# EAGLE design DualRelayShield (EAGLE 5.11)
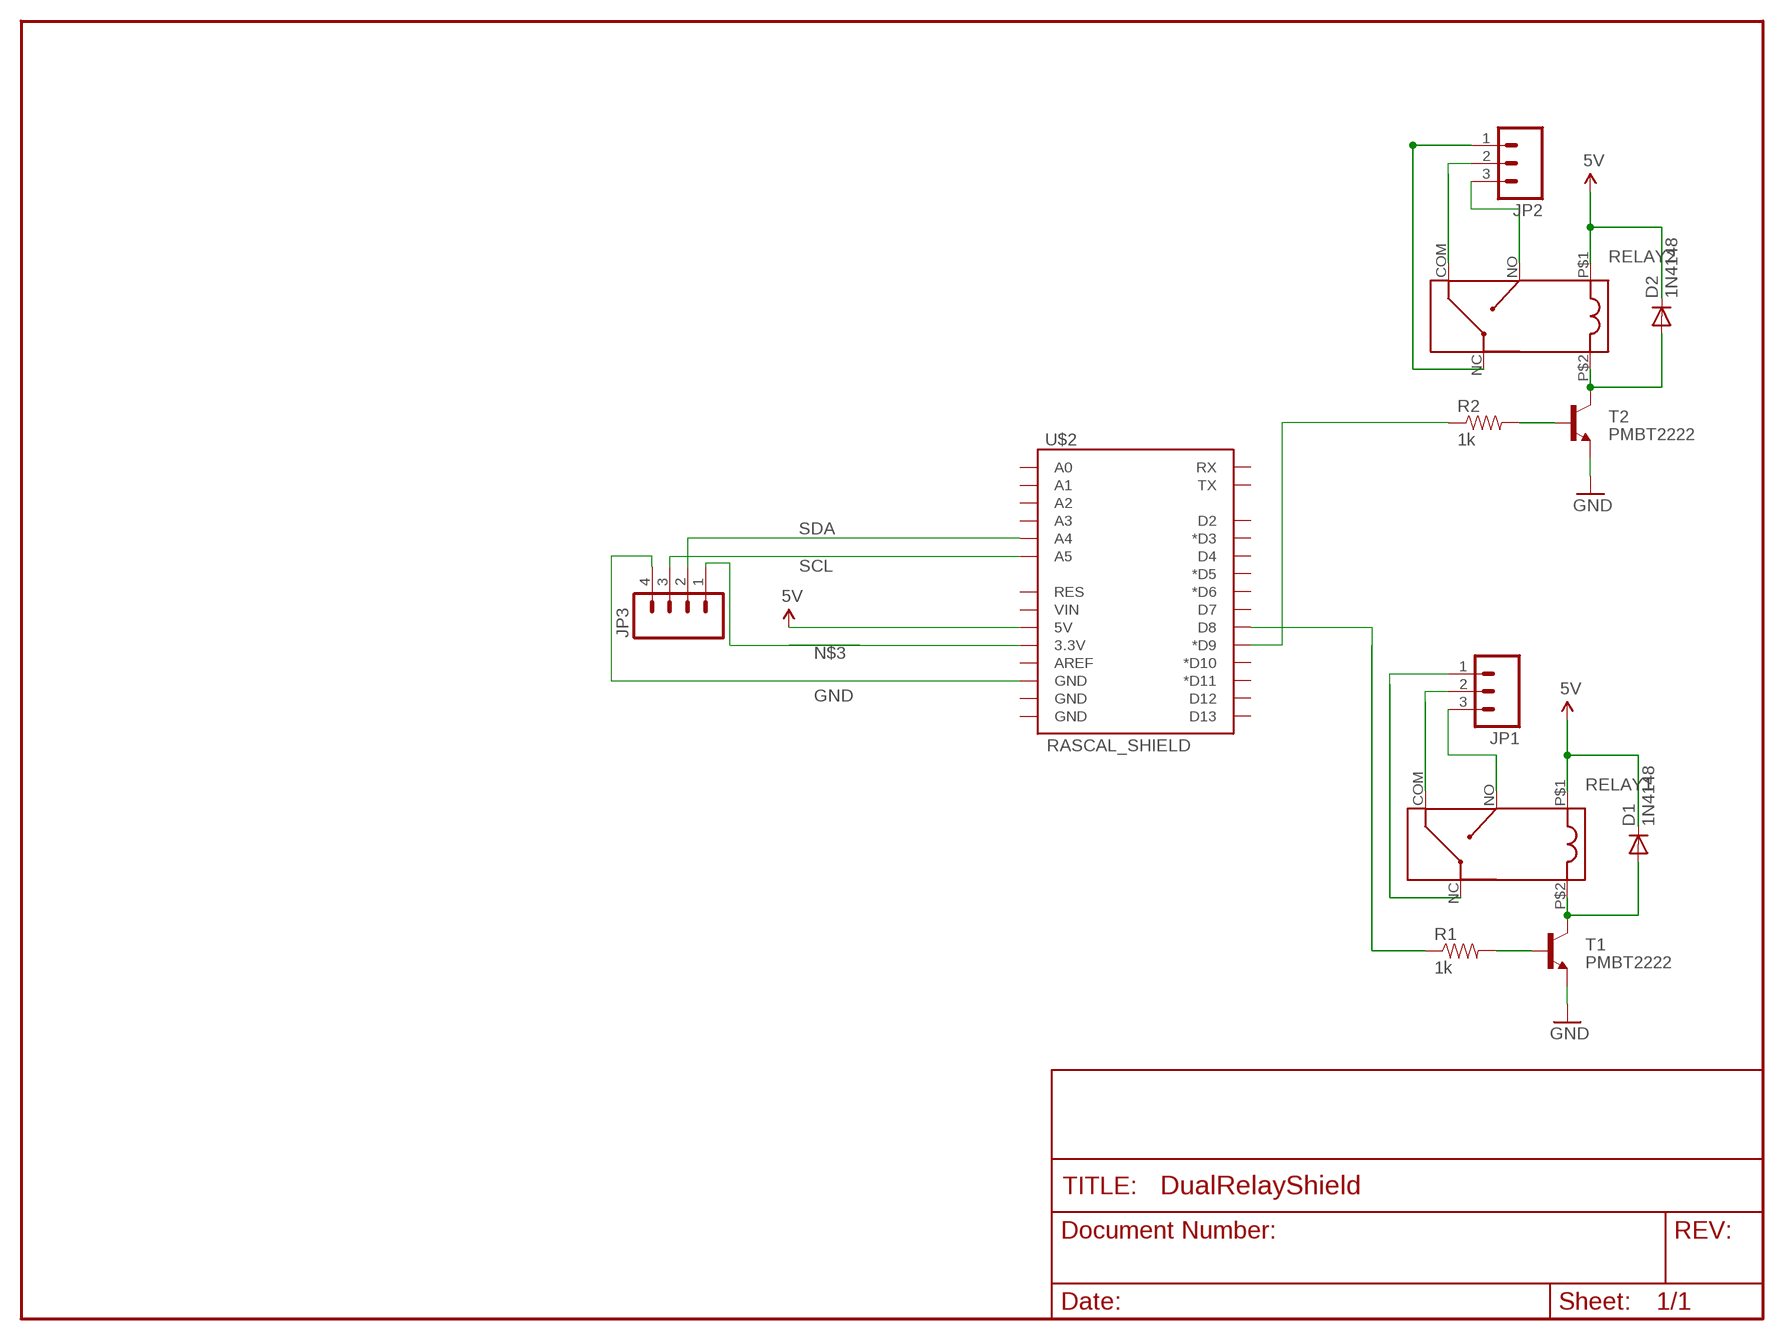
[diagram p0: schematic, sheet 1]

## Parts
D1  1N4148  DIODE1N4148  [DIODE-1N4148]
D2  1N4148  DIODE1N4148  [DIODE-1N4148]
JP1  M03SCREW_LOCK  [SCREWTERMINAL-3.5MM-3_LOCK.007S]
JP2  M03SCREW_LOCK  [SCREWTERMINAL-3.5MM-3_LOCK.007S]
JP3  M04PTH  [1X04]
R1  1k  RESISTORPTH1  [AXIAL-0.3]
R2  1k  RESISTORPTH1  [AXIAL-0.3]
RELAY1  PCH-105D2H,000  [PCH-105D2H,000]
RELAY2  PCH-105D2H,000  [PCH-105D2H,000]
T1  PMBT2222  PMBT2222TO-92  [TO-92]
T2  PMBT2222  PMBT2222TO-92  [TO-92]
U$2  RASCAL_SHIELD  [RASCAL_SHIELD]

## Nets
5V: D1.C D2.C RELAY1.P$1 RELAY2.P$1 U$2.26(5V)
GND: JP3.4 T1.3(E) T2.3(E) U$2.25(GND)
N$2: R1.P$1 U$2.9(D8)
N$4: R2.P$1 U$2.10(*D9)
NPN_B: R1.P$2 T1.2(B)
NPN_B1: R2.P$2 T2.2(B)
NPN_C: D1.A RELAY1.P$2 T1.1(C)
NPN_C1: D2.A RELAY2.P$2 T2.1(C)
RELAY_COM: JP1.2 RELAY1.COM
RELAY_COM1: JP2.2 RELAY2.COM
RELAY_NC: JP1.1 RELAY1.NC
RELAY_NC1: JP2.1 RELAY2.NC
RELAY_NO: JP1.3 RELAY1.NO
RELAY_NO1: JP2.3 RELAY2.NO
SCL: JP3.3 U$2.17(A5)
SDA: JP3.2 U$2.18(A4)
VCC: JP3.1 U$2.27(3.3V)
Unconnected: U$2.1(RX) U$2.2(TX) U$2.3(D2) U$2.4(*D3) U$2.5(D4) U$2.6(*D5) U$2.7(*D6) U$2.8(D7) U$2.11(*D10) U$2.12(*D11) U$2.13(D12) U$2.14(D13) U$2.15(GND) U$2.16(AREF) U$2.19(A3) U$2.20(A2) U$2.21(A1) U$2.22(A0) U$2.23(VIN) U$2.24(GND) U$2.28(RES)

## Library data of the parts
D1 D2 = SparkFun:DIODE: Diode These are standard reverse protection diodes and small signal diodes. SMA package can handle up to about 1A. SOD-323 can handle about 200mA. What the SOD-323 package when ordering, there are some mfgs out there that are 5-pin packages.
JP1 JP2 = SparkFun:M03: Header 3 Standard 3-pin 0.1" header. Use with straight break away headers (SKU : PRT-00116), right angle break away headers (PRT-00553), swiss pins (PRT-00743), machine pins (PRT-00117), and female headers (PRT-00115). Molex polarized connector foot print use with SKU : PRT-08232 with associated crimp pins and housings.
JP3 = SparkFun:M04: Header 4 Standard 4-pin 0.1" header. Use with straight break away headers (SKU : PRT-00116), right angle break away headers (PRT-00553), swiss pins (PRT-00743), machine pins (PRT-00117), and female headers (PRT-00115). Molex polarized connector foot print use with SKU : PRT-08231 with associated crimp pins and housings.
R1 R2 = SparkFun:RESISTOR: Resistor Basic schematic elements and footprints for 0603, 1206, and PTH 1/10th watt (small) resistors.
RELAY1 RELAY2 = Rascal:PCH-105D2H,000
T1 T2 = Rascal:PMBT2222: PMBT2222 NPN transistor SOT-23: Digikey 568-1738-1-ND TO-92: Digikey P2N2222AGOS-ND
U$2 = Rascal:RASCAL_SHIELD

## Board
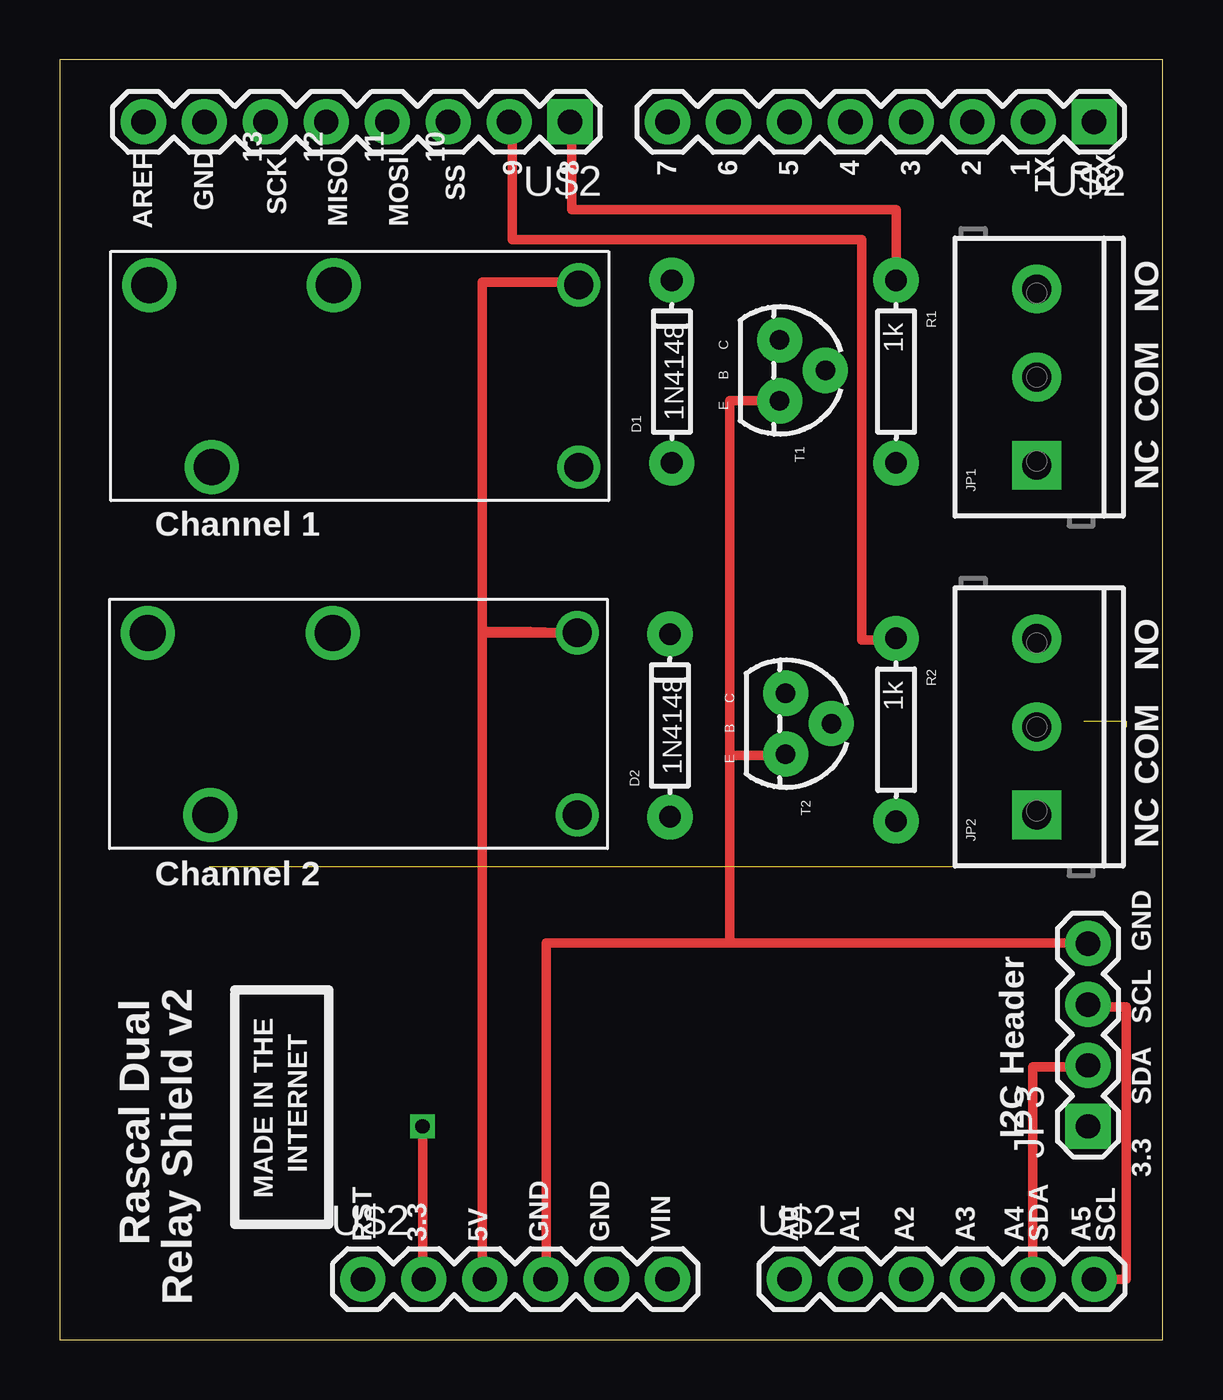
[diagram p1: board, top side]
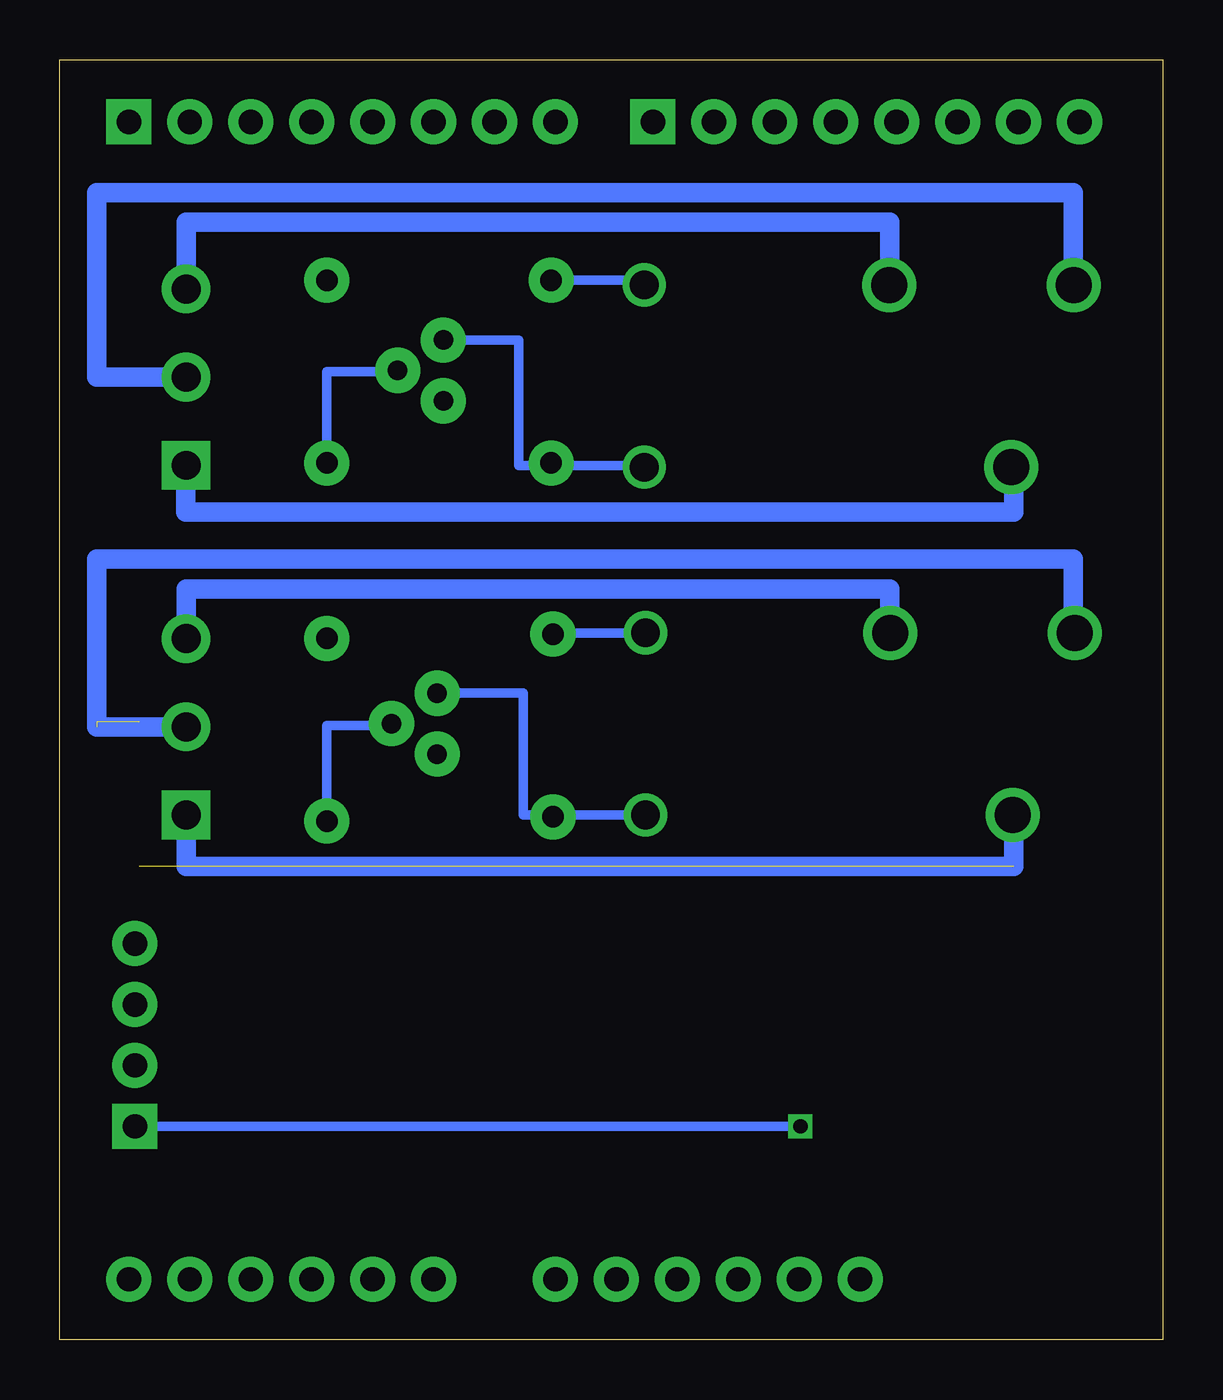
[diagram p2: board, bottom side, seen from below]

Size 45.97 x 53.36 mm. Coordinates in mm from the lower left corner, seen from the top.
Outline: 0,0 45.97,0 45.97,53.35 0,53.35 0,0
Copper layers (1*16): Top 0.035mm / dielectric 1.5mm / Bottom 0.035mm
Design rules "default *": minimum track width 5mil, minimum drill 12mil, track to track 5mil, track to pad 5mil, pad to pad 5mil, via to via 5mil, smd to smd 5mil, copper to edge 0mil, drill to drill 12mil, minimum pad ring 10mil, minimum via ring 8mil, stop-mask expansion 5mil, vias tented up to drill 0mil, thermal gap 10mil

### Footprints (pad centres in the part's own frame; a part is rotated, then mirrored left to right if it is on the bottom)
DIODE-1N4148 = drill 0.9 pad 1.88 round: A -3.81,0; C 3.81,0
SCREWTERMINAL-3.5MM-3_LOCK.007S = drill 1.2 pad 2.032 square: 1 -0.178,0 | drill 1.2 pad 2.032 round: 2 3.5,0; 3 7.178,0
1X04 = drill 1.016 pad 1.88 square: 1 0,0 | drill 1.016 pad 1.88 round: 2 2.54,0; 3 5.08,0; 4 7.62,0
AXIAL-0.3 = drill 0.9 pad 1.88 round: P$1 -3.81,0; P$2 3.81,0
PCH-105D2H,000 = drill 1.5 round: COM 1,7.6; NC 3.6,0; NO 8.7,7.6 | drill 1.2 round: P$1 18.9,7.6; P$2 18.9,0
TO-92 = drill 0.813 pad 1.88 round: 1 -5.08,1.27; 2 -3.81,3.175; 3 -2.54,1.27
RASCAL_SHIELD = drill 1.016 pad 1.88 square: 1 -5.08,49.53; 9 -26.924,49.53 | drill 1.016 pad 1.88 round: 2 -7.62,49.53; 3 -10.16,49.53; 4 -12.7,49.53; 5 -15.24,49.53; 6 -17.78,49.53; 7 -20.32,49.53; 8 -22.86,49.53; 10 -29.464,49.53; 11 -32.004,49.53; 12 -34.544,49.53; 13 -37.084,49.53; 14 -39.624,49.53; 15 -42.164,49.53; 16 -44.704,49.53; 17 -5.08,1.27; 18 -7.62,1.27; 19 -10.16,1.27; 20 -12.7,1.27; 21 -15.24,1.27; 22 -17.78,1.27; 23 -22.86,1.27; 24 -25.4,1.27; 25 -27.94,1.27; 26 -30.48,1.27; 27 -33.02,1.27; 28 -35.56,1.27

### Placement (x,y rotation side)
D1  25.5,40.36 90 top
D2  25.43,25.6 90 top
JP1  40.72,36.63 90 top
JP2  40.72,22.05 90 top
JP3  42.85,8.89 90 top
R1  34.85,40.36 270 top
R2  34.85,25.43 270 top
RELAY1  2.72,36.37 0 top
RELAY2  2.67,21.87 0 top
T1  28.73,36.6 270 top
T2  28.98,21.87 270 top
U$2  48.18,1.24 0 top

### Tracks (layer width: path | path; a pad name or v marks a point on that pad's centre or on a via)
5V
  Top 0.406: U$2.26 17.6,2.52 17.6,29.47 | 17.6,29.47 17.6,29.52 | 17.6,29.52 19.61,29.52 RELAY2.P$1 17.6,29.47 | 17.6,29.52 17.6,44.09 21.44,44.09 RELAY1.P$1
  Bottom 0.406: RELAY2.P$1 25.43,29.47 D2.C | D1.C 21.62,44.17 RELAY1.P$1
GND
  Top 0.406: T1.3 27.91,39.14 27.91,24.36 | 27.91,24.36 30.25,24.36 T2.3 | U$2.25 20.27,2.52 20.27,16.54 27.91,16.54 | 27.91,16.54 27.91,24.36 | 27.91,16.54 42.85,16.54 JP3.4
N$2
  Top 0.406: U$2.9 21.34,50.77 21.34,47.12 34.85,47.12 R1.P$1
N$4
  Top 0.406: U$2.10 18.85,50.77 18.85,45.87 33.43,45.87 33.43,29.16 34.85,29.16 R2.P$1
NPN_B
  Bottom 0.406: R1.P$2 34.85,40.36 31.9,40.36 T1.2
NPN_B1
  Bottom 0.406: R2.P$2 34.85,25.6 32.16,25.6 T2.2
NPN_C
  Bottom 0.406: T1.1 26.85,41.68 26.85,36.45 25.5,36.45 | D1.A 25.5,36.45 | 25.5,36.45 21.62,36.45 RELAY1.P$2
NPN_C1
  Bottom 0.406: RELAY2.P$2 25.43,21.87 | T2.1 26.67,26.95 26.67,21.87 25.43,21.87 | 25.43,21.87 D2.A
RELAY_COM
  Bottom 0.406: RELAY1.COM 3.73,43.97
  Bottom 0.813: 3.73,43.97 3.73,47.83 44.45,47.83 44.45,40.13 JP1.2
RELAY_COM1  (2 unrouted)
  Bottom 0.406: RELAY2.COM 3.73,29.47
  Bottom 0.813: 3.73,29.47 3.73,32.54 44.45,32.54 44.45,25.55 JP2.2
RELAY_NC
  Bottom 0.406: 6.22,36.37 RELAY1.NC | 40.74,36.45 JP1.1
  Bottom 0.813: 6.22,36.37 6.22,34.49 40.74,34.49 40.74,36.45
RELAY_NC1  (1 unrouted)
  Bottom 0.406: 6.22,21.87 RELAY2.NC
  Bottom 0.813: 6.22,21.87 6.22,19.74 40.72,19.74 JP2.1
RELAY_NO
  Bottom 0.406: 11.38,43.97 RELAY1.NO | 40.72,46.58 40.74,46.58
  Bottom 0.813: 11.38,43.97 11.38,46.58 40.72,46.58 JP1.3
RELAY_NO1
  Bottom 0.406: RELAY2.NO
  Bottom 0.813: RELAY2.NO 11.38,31.29 40.72,31.29 JP2.3
SCL
  Top 0.406: U$2.17 44.45,2.52 44.45,13.87 42.85,13.87 JP3.3
SDA
  Top 0.406: U$2.18 40.54,2.52 40.54,11.38 42.85,11.38 JP3.2
VCC  (via drill 0.6)
  Top 0.406: U$2.27 15.11,2.52 v15.11,8.89
  Bottom 0.406: v15.11,8.89 JP3.1

### Text on the board
tPlace: 13 | 12 | 11 | 10 | 9 | 8 | 7 | 6 | 5 | 4 | 3 | 2 | 1 | 0 | TX | RX | GND | SCK | SS | AREF | MISO | MOSI | NO | COM | NC | Channel 1 | NO | COM | NC | Channel 2 | GND | SCL | SDA | I2C Header | INTERNET | 3.3 | MADE IN THE | Rascal Dual | RST | 3.3 | 5V | GND | GND | VIN | A0 | A1 | A2 | A3 | A4 | SDA | A5 | SCL | Relay Shield v2